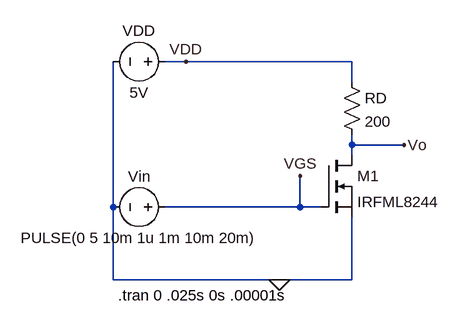
[diagram p0: schematic 3_3_1_e.asc]
3_3_1_e.asc, the LTspice schematic file:
Version 4
SHEET 1 880 680
WIRE 128 -64 96 -64
WIRE 384 -64 128 -64
WIRE 384 -32 384 -64
WIRE 384 64 384 48
WIRE 464 64 384 64
WIRE 384 80 384 64
WIRE 16 160 16 -64
WIRE 304 160 304 112
WIRE 304 160 96 160
WIRE 336 160 304 160
WIRE 16 272 16 160
WIRE 272 272 16 272
WIRE 384 272 384 176
WIRE 384 272 272 272
FLAG 272 272 0
FLAG 464 64 Vo
FLAG 304 112 VGS
FLAG 128 -64 VDD
SYMBOL voltage 112 160 R90
WINDOW 0 -32 56 VBottom 2
WINDOW 3 32 56 VTop 2
WINDOW 123 0 0 Left 0
WINDOW 39 0 0 Left 0
SYMATTR InstName Vin
SYMATTR Value PULSE(0 5 10m 1u 1m 10m 20m)
SYMBOL res 368 -48 R0
SYMATTR InstName RD
SYMATTR Value 200
SYMBOL voltage 112 -64 R90
WINDOW 0 -32 56 VBottom 2
WINDOW 3 32 56 VTop 2
SYMATTR InstName VDD
SYMATTR Value 5V
SYMBOL nmos 336 80 R0
SYMATTR InstName M1
SYMATTR Value IRFML8244
TEXT 24 296 Left 2 !.tran 0 .025s 0s .00001s

The netlist it stands for:
* 3_3_1_e.asc
Vin VGS 0 PULSE(0 5 10m 1u 1m 10m 20m)
RD VDD Vo 200
VDD VDD 0 5V
M1 Vo VGS 0 0 IRFML8244
.model NMOS NMOS
.model PMOS PMOS
.lib standard.mos
.tran 0 .025s 0s .00001s
.backanno
.end